# EAGLE design Rectifier (EAGLE 7.3.0)
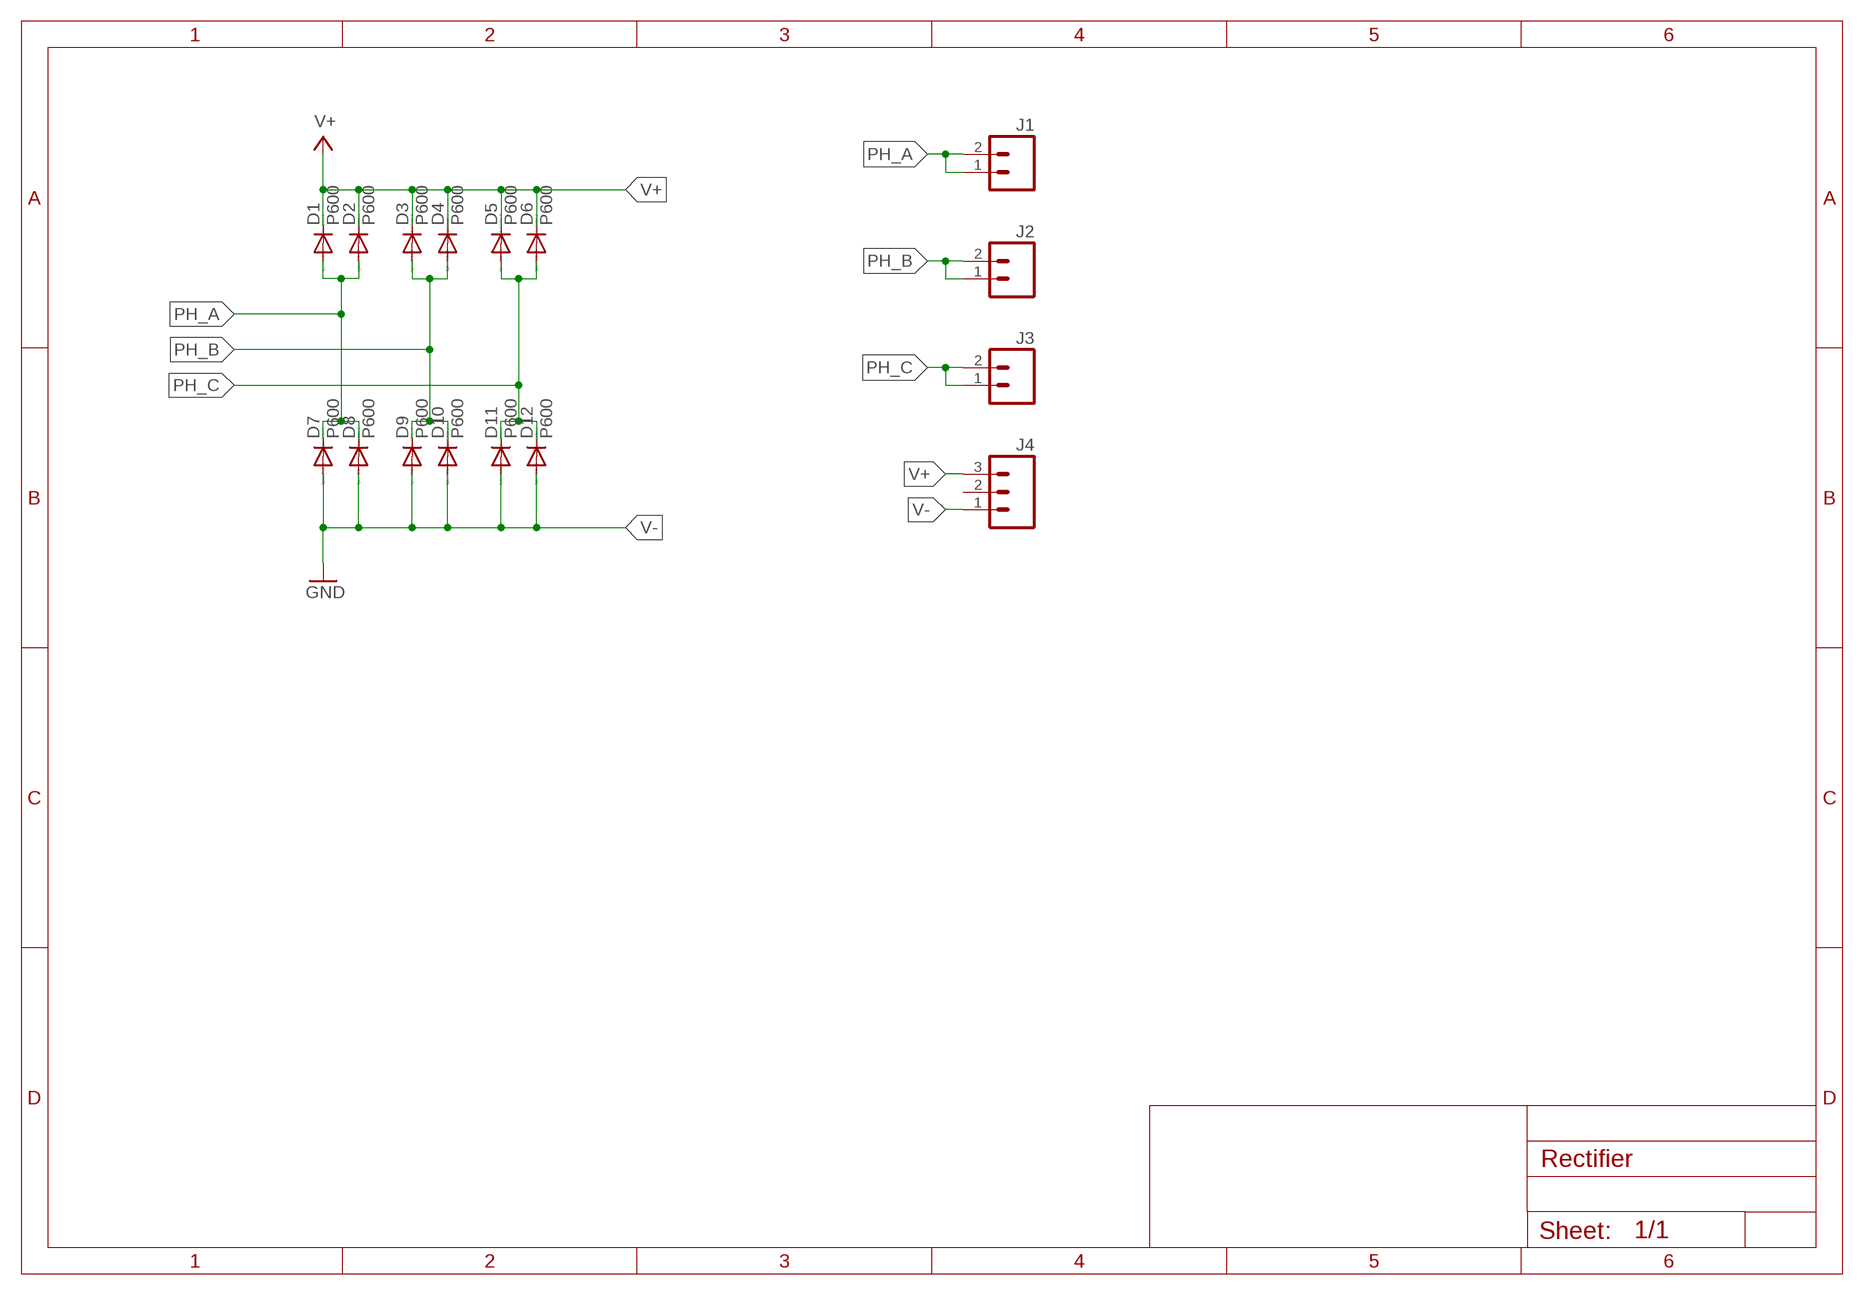
[diagram p0: schematic, sheet 1]

## Parts
D1  P600  [P6-15]
D2  P600  [P6-15]
D3  P600  [P6-15]
D4  P600  [P6-15]
D5  P600  [P6-15]
D6  P600  [P6-15]
D7  P600  [P6-15]
D8  P600  [P6-15]
D9  P600  [P6-15]
D10  P600  [P6-15]
D11  P600  [P6-15]
D12  P600  [P6-15]
J1  M025MM  [SCREWTERMINAL-5MM-2]
J2  M025MM  [SCREWTERMINAL-5MM-2]
J3  M025MM  [SCREWTERMINAL-5MM-2]
J4  M03-SCREW-5MM  [SCREWTERMINAL-5MM-3]

## Nets
PH_A: D1.A D2.A D7.C D8.C J1.1 J1.2
PH_B: D3.A D4.A D9.C D10.C J2.1 J2.2
PH_C: D5.A D6.A D11.C D12.C J3.1 J3.2
V+: D1.C D2.C D3.C D4.C D5.C D6.C J4.3
V-: D7.A D8.A D9.A D10.A D11.A D12.A J4.1 ; supply symbol labelled GND
Unconnected: J4.2

## Library data of the parts
D1-D12 = diode:P600: DIODE high voltage diode, silicon rectifier 1.0 A to 6.0 A, 50 V to 1300 V http://www.kosemi.com/product/diosr.html
J1-J3 = SparkFun-Connectors:M02: Standard 2-pin 0.1" header. Use with - straight break away headers ( PRT-00116) - right angle break away headers (PRT-00553) - swiss pins (PRT-00743) - machine pins (PRT-00117) - female headers (PRT-00115) Molex polarized connector foot print use with: PRT-08233 with associated crimp pins and housings. 2.54_SCREWTERM for use with PRT-10571. 3.5mm Screw Terminal footprints for PRT-08084 5mm Screw Terminal footprints for use with PRT-08432; STOREFRONT_ID: PRT-08432
J4 = SparkFun-Connectors:M03: Header 3 Standard 3-pin 0.1" header. Use with straight break away headers (SKU : PRT-00116), right angle break away headers (PRT-00553), swiss pins (PRT-00743), machine pins (PRT-00117), and female headers (PRT-00115). Molex polarized connector foot print use with SKU : PRT-08232 with associated crimp pins and housings.; STOREFRONT_ID: PRT-08433

## Board
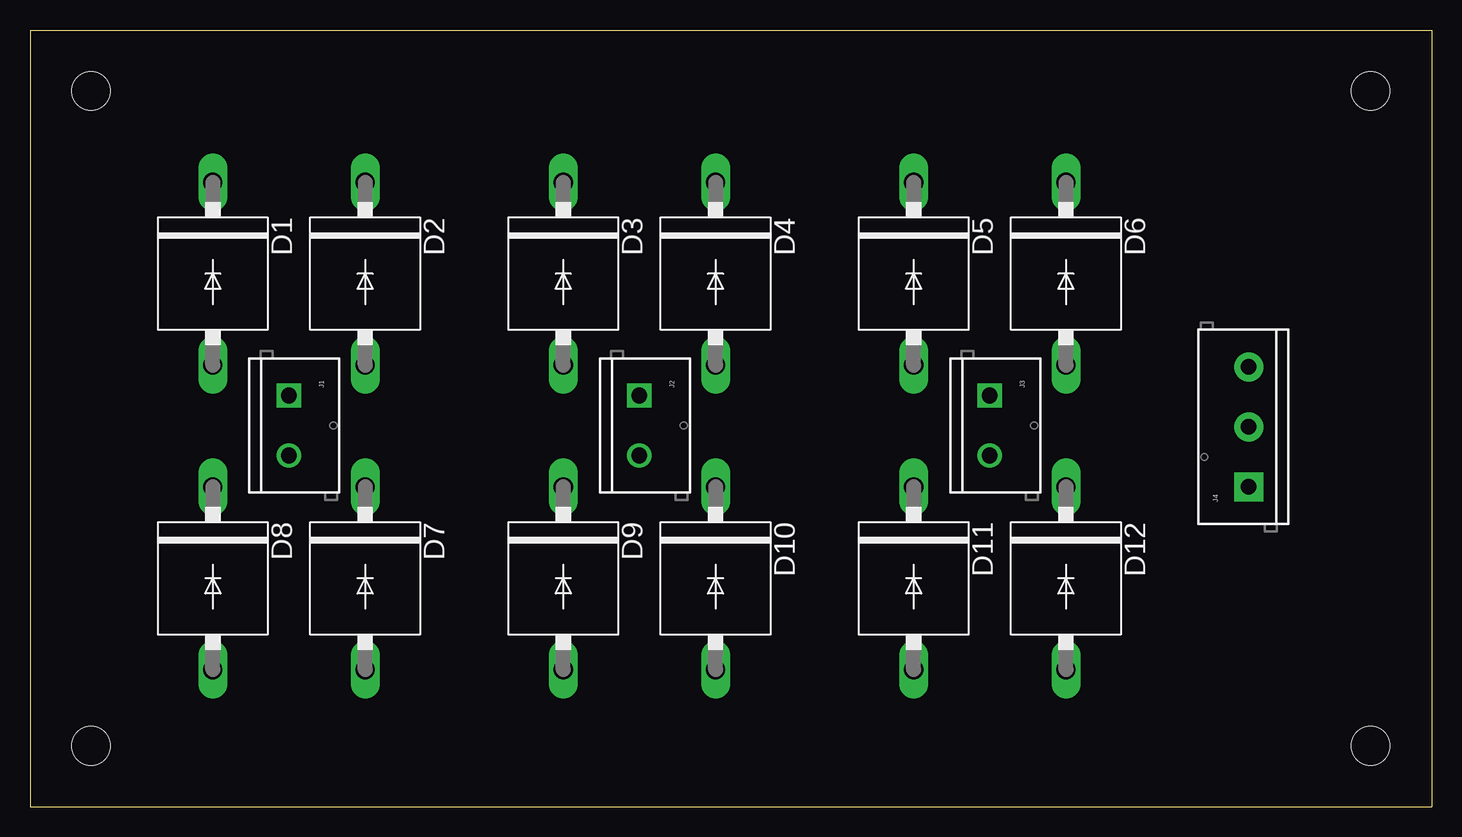
[diagram p1: board, top side]
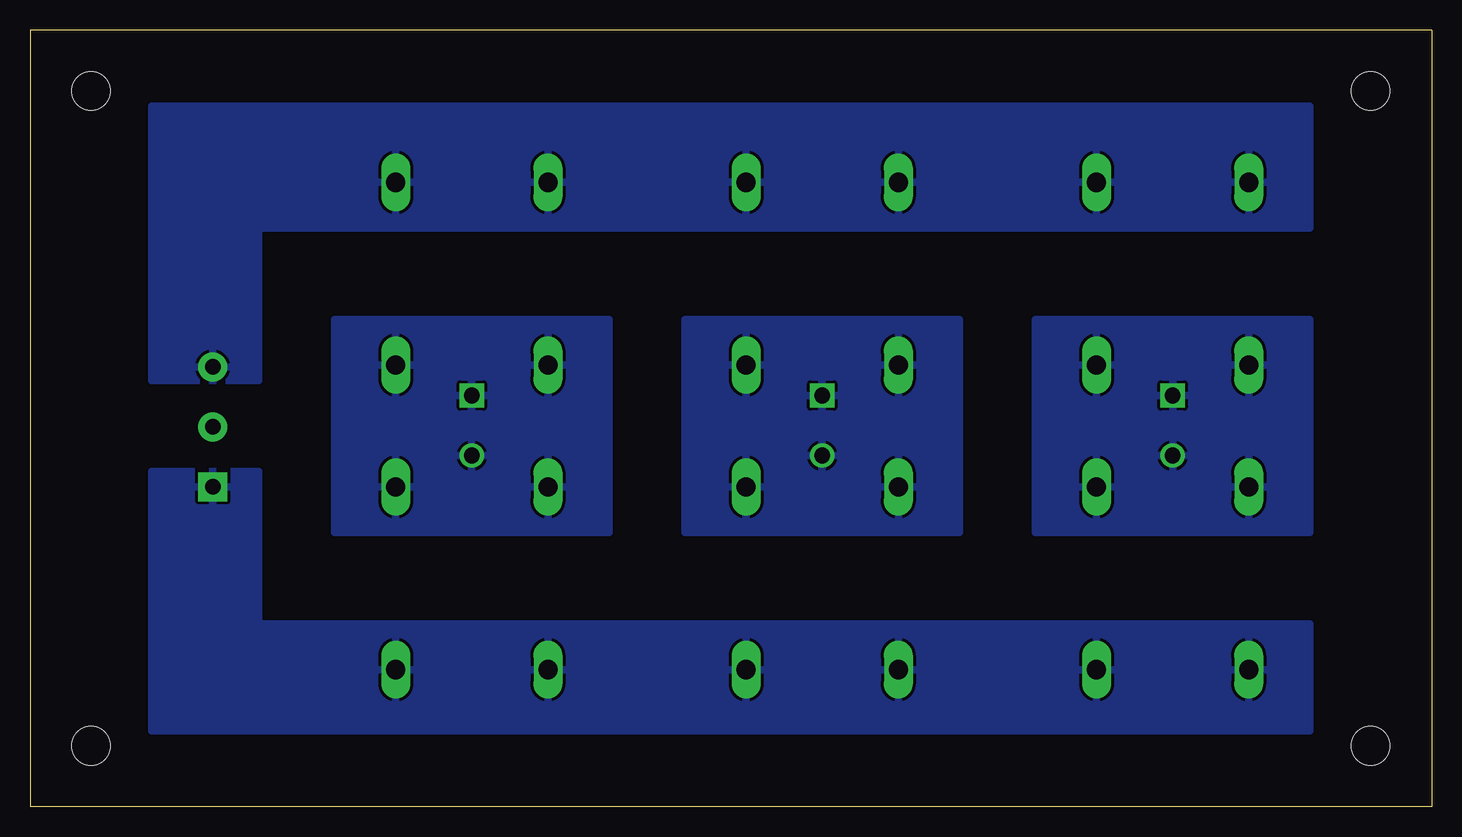
[diagram p2: board, bottom side, seen from below]

Size 116.84 x 64.77 mm. Coordinates in mm from the lower left corner, seen from the top.
Outline: 0,64.76 0,0 116.84,0 116.84,64.77 0,64.77
Copper layers (1*16): Top 0.035mm / dielectric 1.5mm / Bottom 0.035mm
Design rules "default *": minimum track width 10mil, minimum drill 24mil, track to track 20mil, track to pad 8mil, pad to pad 8mil, via to via 8mil, smd to smd 8mil, copper to edge 40mil, drill to drill 8mil, minimum pad ring 10mil, minimum via ring 8mil, stop-mask expansion 4mil, vias tented up to drill 0mil, thermal gap 10mil
Holes 3.2 mm at 5.08,59.69 5.08,5.08 111.76,5.08 111.76,59.69

### Footprints (pad centres in the part's own frame; a part is rotated, then mirrored left to right if it is on the bottom)
P6-15 = drill 1.6 long: A 7.62,0; C -7.62,0
SCREWTERMINAL-5MM-2 = drill 1.3 pad 2.032 square: 1 0,0 | drill 1.3 pad 2.032: 2 5,0
SCREWTERMINAL-5MM-3 = drill 1.3 pad 2.413 square: 1 0,0 | drill 1.3 pad 2.413: 2 5,0; 3 10,0

### Placement (x,y rotation side)
D1  15.24,44.45 270 top
D2  27.94,44.45 270 top
D3  44.45,44.45 270 top
D4  57.15,44.45 270 top
D5  73.66,44.45 270 top
D6  86.36,44.45 270 top
D7  27.94,19.05 270 top
D8  15.24,19.05 270 top
D9  44.45,19.05 270 top
D10  57.15,19.05 270 top
D11  73.66,19.05 270 top
D12  86.36,19.05 270 top
J1  21.59,34.29 270 top
J2  50.8,34.29 270 top
J3  80.01,34.29 270 top
J4  101.6,26.67 90 top

### Tracks (layer width: path | path; a pad name or v marks a point on that pad's centre or on a via)
PH_A
  pour Bottom: 10.16,40.64 33.02,40.64 33.02,22.86 10.16,22.86
PH_B
  pour Bottom: 39.37,40.64 62.23,40.64 62.23,22.86 39.37,22.86
PH_C
  pour Bottom: 68.58,40.64 91.44,40.64 91.44,22.86 68.58,22.86
V+
  pour Bottom: 10.16,48.26 97.79,48.26 97.79,35.56 106.68,35.56 106.68,58.42 10.16,58.42
V-
  pour Bottom: 10.16,15.24 97.79,15.24 97.79,27.94 106.68,27.94 106.68,6.35 10.16,6.35